# EasyEDA Pro project Loongson_Drivers.epro, board PCB1
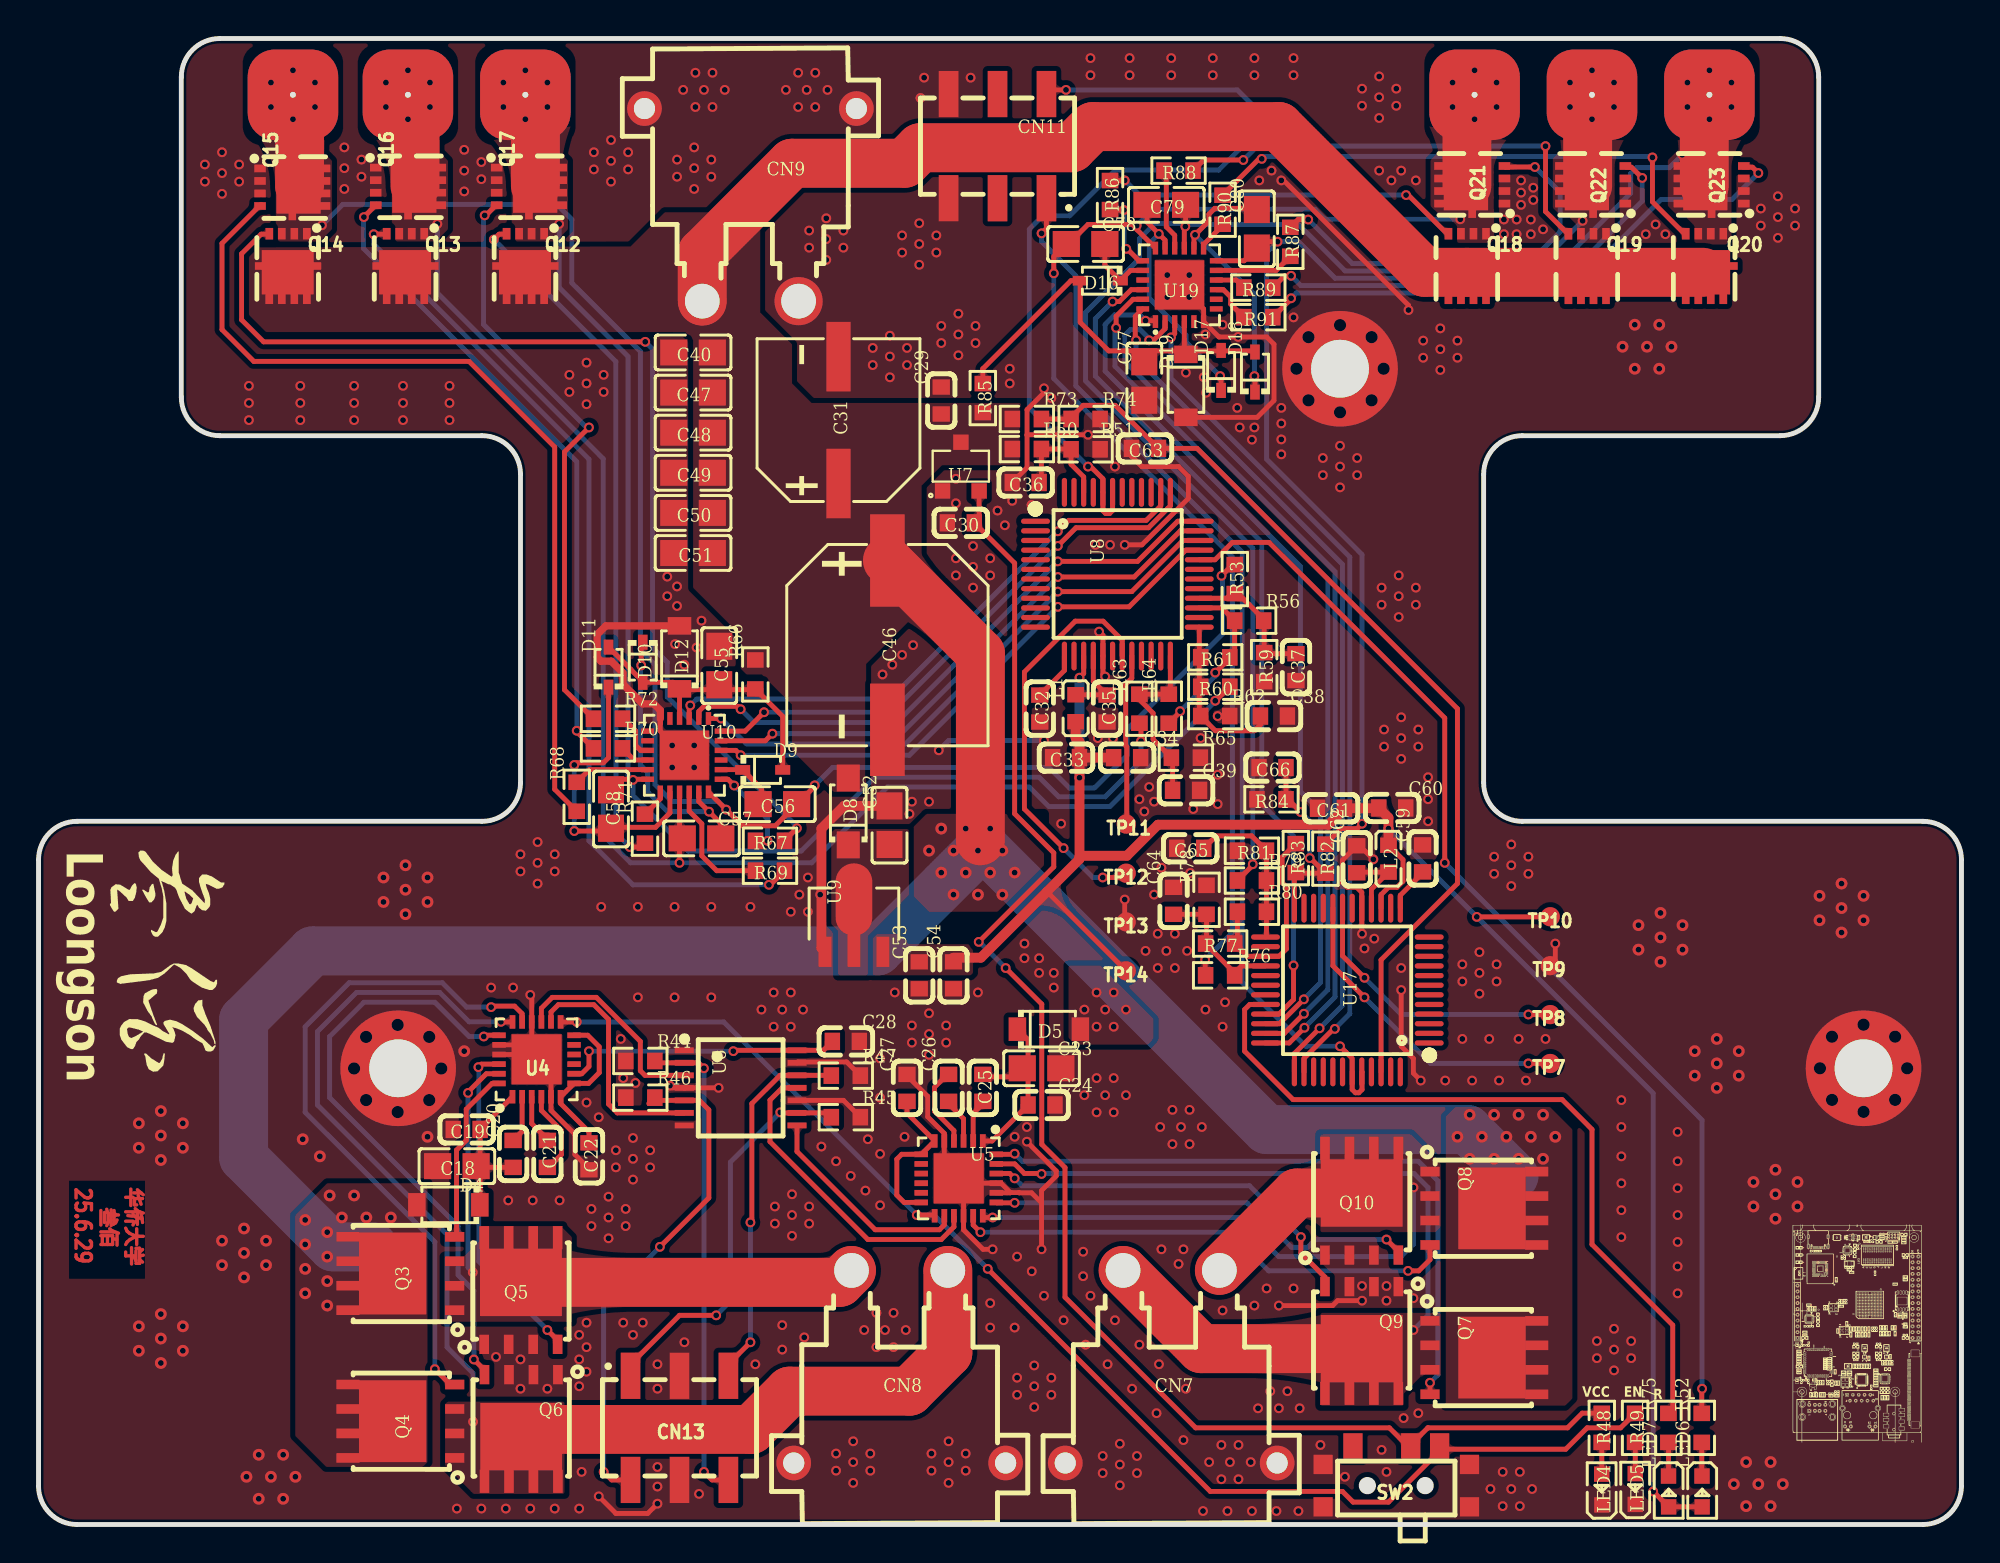
[diagram p3: board, top side]
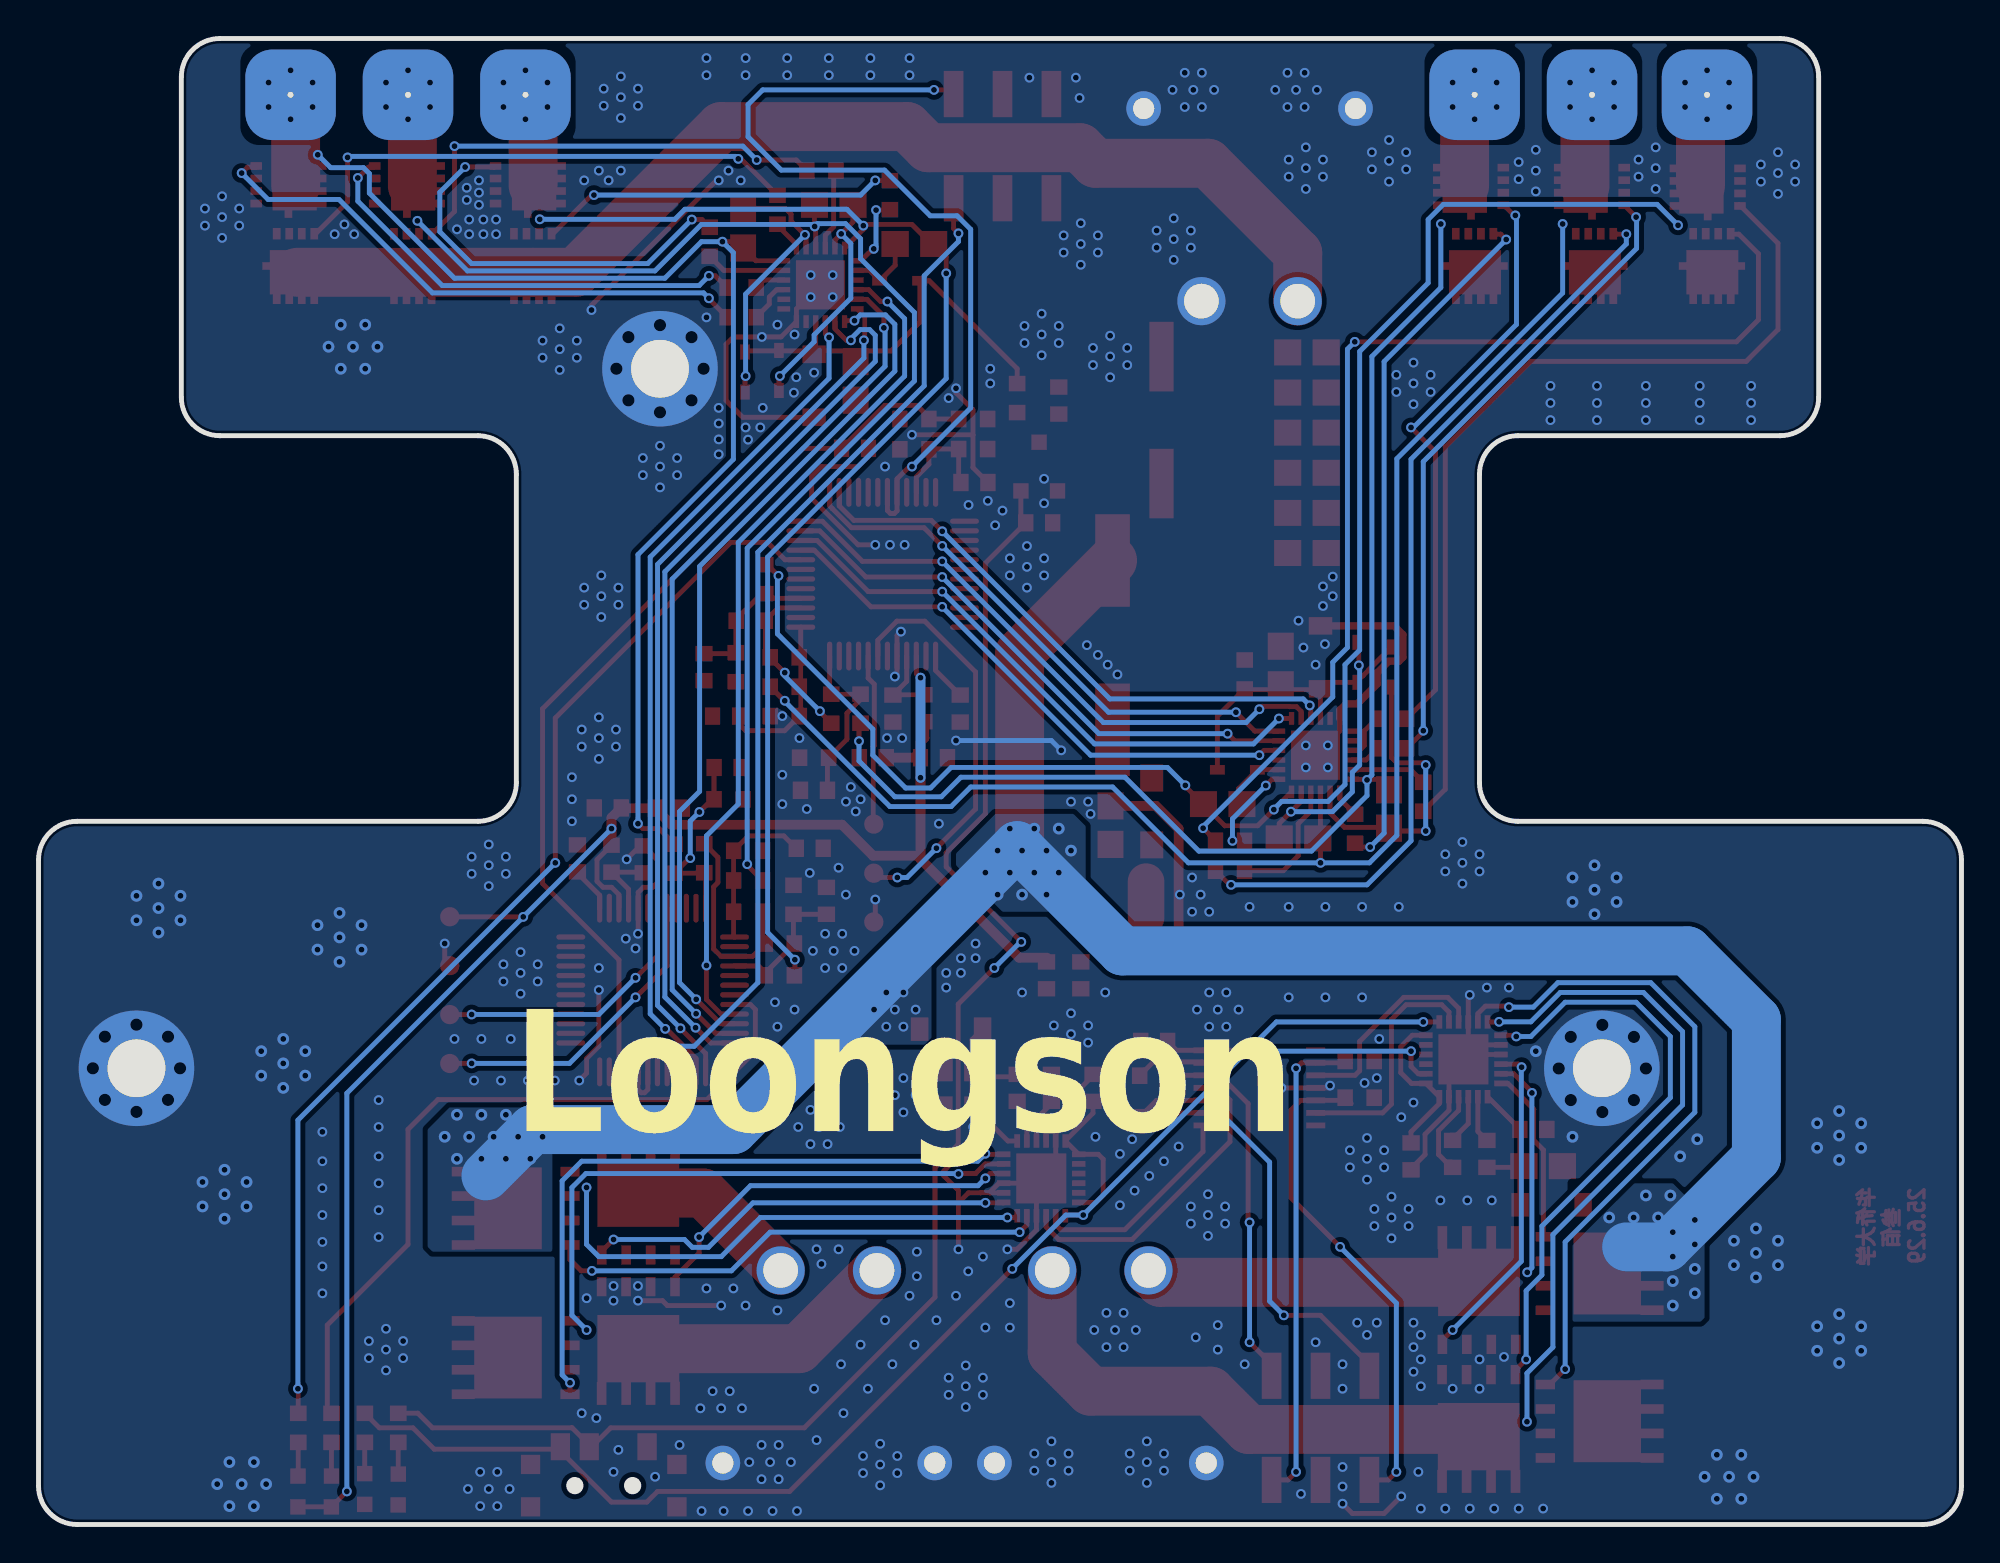
[diagram p4: board, bottom side, seen from below]

Outline 99.83 x 77.15 mm; copper layers: Top Layer, Bottom Layer. Coordinates in mm from the lower left corner of the outline.
Outline path: 0,34.51 arc(0.59,35.92) 2,36.51 23.02,36.51 arc(24.44,37.09) 25.02,38.51 25.02,54.53 arc(24.44,55.95) 23.02,56.53 9.41,56.53 arc(8,57.12) 7.41,58.53 7.41,75.15 arc(8,76.57) 9.41,77.15 90.41,77.15 arc(91.83,76.57) 92.41,75.15 92.41,58.53 arc(91.83,57.12) 90.41,56.53 77.02,56.53 arc(75.61,55.95) 75.02,54.53 75.02,38.51 arc(75.61,37.09) 77.02,36.51 97.83,36.51 arc(99.24,35.92) 99.83,34.51 99.83,2 arc(99.24,0.59) 97.83,0 2,0 arc(0.59,0.59) 0,2 0,34.51
Stack: Top Layer 0.035mm / Dielectric1 1.51mm FR4 er 4.5 / Bottom Layer 0.035mm

## Design rules (mm)
template: 自定义配置
spacing copperThickness1oz (default): track to track 0.102, other pairs 0.152 to 0.3
spacing copperThickness2oz: track to track 0.203, other pairs 0.152 to 0.3
track width copperThickness1oz (default): min 0.127, default 0.254, max 2.54
track width copperThickness2oz: min 0.203, default 0.254, max 2.54
differential pair differentialPair (default): width min 0.127, default 0.254, max 2.54; gap min 0.152, default 0.152
via viaSize (default): diameter min 0.5, default 0.61, max 10; hole min 0.3, default 0.305, max 6.3

## Placement (name value [footprint] x y rotation side)
C18  10uF  [C0805]  21.72 18.61 0 top
C19  100nF  [C0603]  22.22 20.51 0 top
C20  1uF  [C0603]  24.64 19.24 270 top
C21  100nF  [C0603]  26.42 19.24 90 top
C22  1uF  [C0603]  28.57 19.11 90 top
C23  10uF  [C0805]  52.07 23.69 180 top
C24  100nF  [C0603]  52.07 21.78 180 top
C25  1uF  [C0603]  49.02 22.67 90 top
C26  100nF  [C0603]  47.24 22.67 270 top
C27  1uF  [C0603]  45.08 22.67 270 top
C28  1uF  [C0603]  41.91 25.08 180 top
C29  1uF  [C0603]  46.86 58.36 270 top
C30  1uF  [C0603]  47.88 52.01 0 top
C31  220uF  [CAP-SMD_BD8.0-L8.3-W8.3-LS9.1-FD]  41.53 57.34 90 top
C32  100nF  [C0603]  51.98 42.36 90 top
C33  100nF  [C0603]  53.34 39.81 0 top
C34  10uF  [C0603]  56.51 39.81 180 top
C35  100nF  [C0603]  55.47 42.36 90 top
C36  100nF  [C0603]  51.24 54.1 0 top
C37  100nF  [C0603]  65.28 44.51 90 top
C38  100nF  [C0603]  64.13 41.97 180 top
C39  100nF  [C0603]  59.57 38.12 180 top
C40  22uF  [C0805]  33.98 60.85 0 top
C46  470uF  [CAP-SMD_BD10.0-L10.3-W10.3-LS11.0-R-RD]  44.07 45.66 90 top
C47  22uF  [C0805]  33.98 58.77 0 top
C48  22uF  [C0805]  33.98 56.69 0 top
C49  22uF  [C0805]  33.98 54.6 0 top
C50  22uF  [C0805]  33.98 52.52 0 top
C51  22uF  [C0805]  33.98 50.44 0 top
C52  22uF  [C0805]  44.18 36.31 270 top
C53  10uF  [C0603]  45.72 28.51 270 top
C54  100nF  [C0603]  47.5 28.51 270 top
C55  22uF  [C0805]  35.34 44.6 90 top
C56  4.7uF  [C0805]  38.35 37.4 0 top
C57  4.7uF  [C0805]  34.42 35.62 180 top
C58  4.7uF  [C0805]  29.72 37.15 90 top
C59  100nF  [C0603]  71.85 34.59 270 top
C60  100nF  [C0603]  70.28 37.2 180 top
C61  10uF  [C0603]  67.1 37.19 0 top
C62  100nF  [C0603]  68.43 34.54 270 top
C63  100nF  [C0603]  57.44 55.87 0 top
C64  100nF  [C0603]  58.92 32.38 270 top
C65  100nF  [C0603]  59.79 35.11 0 top
C66  100nF  [C0603]  64.06 39.3 0 top
C77  22uF  [C0805]  57.4 59.37 270 top
C78  4.7uF  [C0805]  54.36 66.48 180 top
C79  4.7uF  [C0805]  58.55 68.52 0 top
C80  4.7uF  [C0805]  63.25 67.27 270 top
CN7  XT30PW-M30.G.Y  [CONN-TH_XT30PW-M]  58.8 8.19 0 top
CN8  XT30PW-M30.G.Y  [CONN-TH_XT30PW-M]  44.7 8.19 0 top
CN9  XT30PW-M30.G.Y  [CONN-TH_XT30PW-M]  36.96 68.52 180 top
CN11  PM254-2-03-S-8.5  [HDR-SMD_6P-P2.54-V-F-R2-C3-LS7.0]  49.78 71.56 180 top
CN13  PM254-2-03-S-8.5  [HDR-SMD_6P-P2.54-V-F-R2-C3-LS7.0]  33.27 5.02 0 top
D4  1N5819HW  [SOD-123_L2.7-W1.6-LS3.7-RD]  21.28 16.6 180 top
D5  1N5819HW  [SOD-123_L2.7-W1.6-LS3.7-RD]  52.45 25.72 0 top
D8  DSK34  [SOD-123FL_L2.7-W1.8-LS3.8-RD]  42.04 37.02 90 top
D9  B5819WS  [SOD-323_L1.7-W1.3-LS2.5-FD]  37.59 39.18 180 top
D10  B5819WS  [SOD-323_L1.7-W1.3-LS2.5-FD]  31.37 44.77 90 top
D11  B5819WS  [SOD-323_L1.7-W1.3-LS2.5-FD]  29.59 44.51 270 top
D12  BZT52C15  [SOD-123_L2.7-W1.6-LS3.7-RD]  33.27 45.02 90 top
D16  B5819WS  [SOD-323_L1.7-W1.3-LS2.5-FD]  55.12 64.58 0 top
D17  B5819WS  [SOD-323_L1.7-W1.3-LS2.5-FD]  61.39 59.92 270 top
D18  B5819WS  [SOD-323_L1.7-W1.3-LS2.5-FD]  63.15 59.84 270 top
D19  BZT52C15  [SOD-123_L2.7-W1.6-LS3.7-RD]  59.56 59.12 270 top
L1  MLB1608F-000T  [L0603]  53.84 42.38 270 top
L2  MLB1608F-000T  [L0603]  70.08 34.57 90 top
LED4  NCD0603R1  [LED0603-RD_RED]  81.15 1.81 90 top
LED5  NCD0603B1  [LED0603-RD]  82.89 1.84 90 top
LED6  NCD0603R1  [LED0603-RD_RED]  86.36 1.71 270 top
LED7  NCD0603R1  [LED0603-RD_RED]  84.62 1.71 270 top
NOREF  -  [Pad_e1275]  94.74 23.69 0 top
NOREF#2  -  [Pad_e35]  74.55 74.23 0 top
NOREF#3  -  [Pad_e41]  80.64 74.23 0 top
NOREF#4  -  [Pad_e86]  25.27 74.23 0 top
NOREF#5  -  [Pad_e85]  19.18 74.23 0 top
NOREF#6  -  [Pad_e216]  67.56 60.01 0 top
NOREF#7  -  [Pad_e84]  13.21 74.23 0 top
NOREF#8  -  [Pad_e42]  86.74 74.23 0 top
NOREF#9  -  [Pad_e1305]  18.67 23.69 0 top
Q3  TPH1R403NL  [DSOP-8_L5.0-W5.0-P1.27-LS6.0-BL-EP]  18.83 13.03 90 top
Q4  TPH1R403NL  [DSOP-8_L5.0-W5.0-P1.27-LS6.0-BL-EP]  18.83 5.36 90 top
Q5  TPH1R403NL  [DSOP-8_L5.0-W5.0-P1.27-LS6.0-BL-EP]  25.04 12.12 0 top
Q6  TPH1R403NL  [DSOP-8_L5.0-W5.0-P1.27-LS6.0-BL-EP]  25.06 5.01 180 top
Q7  TPH1R403NL  [DSOP-8_L5.0-W5.0-P1.27-LS6.0-BL-EP]  75 8.67 270 top
Q8  TPH1R403NL  [DSOP-8_L5.0-W5.0-P1.27-LS6.0-BL-EP]  75 16.42 270 top
Q9  TPH1R403NL  [DSOP-8_L5.0-W5.0-P1.27-LS6.0-BL-EP]  68.69 9.58 180 top
Q10  TPH1R403NL  [DSOP-8_L5.0-W5.0-P1.27-LS6.0-BL-EP]  68.69 16.76 0 top
Q12  TPN2R805PL,L1Q  [TSON-8_L3.1-W3.1-P0.65-LS3.3-BL-EP]  25.27 65.34 180 top
Q13  TPN2R805PL,L1Q  [TSON-8_L3.1-W3.1-P0.65-LS3.3-BL-EP]  19.05 65.34 180 top
Q14  TPN2R805PL,L1Q  [TSON-8_L3.1-W3.1-P0.65-LS3.3-BL-EP]  12.95 65.34 180 top
Q15  TPN2R805PL,L1Q  [TSON-8_L3.1-W3.1-P0.65-LS3.3-BL-EP]  13.17 69.43 270 top
Q16  TPN2R805PL,L1Q  [TSON-8_L3.1-W3.1-P0.65-LS3.3-BL-EP]  19.18 69.47 270 top
Q17  TPN2R805PL,L1Q  [TSON-8_L3.1-W3.1-P0.65-LS3.3-BL-EP]  25.46 69.47 270 top
Q18  TPN2R805PL,L1Q  [TSON-8_L3.1-W3.1-P0.65-LS3.3-BL-EP]  74.17 65.34 180 top
Q19  TPN2R805PL,L1Q  [TSON-8_L3.1-W3.1-P0.65-LS3.3-BL-EP]  80.4 65.34 180 top
Q20  TPN2R805PL,L1Q  [TSON-8_L3.1-W3.1-P0.65-LS3.3-BL-EP]  86.49 65.34 180 top
Q21  TPN2R805PL,L1Q  [TSON-8_L3.1-W3.1-P0.65-LS3.3-BL-EP]  74.43 69.56 90 top
Q22  TPN2R805PL,L1Q  [TSON-8_L3.1-W3.1-P0.65-LS3.3-BL-EP]  80.7 69.56 90 top
Q23  TPN2R805PL,L1Q  [TSON-8_L3.1-W3.1-P0.65-LS3.3-BL-EP]  86.85 69.56 90 top
R44  10kΩ  [R0603]  31.24 24.07 180 top
R45  10kΩ  [R0603]  41.91 21.15 180 top
R46  10kΩ  [R0603]  31.24 22.16 180 top
R47  10kΩ  [R0603]  41.91 23.3 180 top
R48  2.2kΩ  [R0603]  81.15 5.02 90 top
R49  2.2kΩ  [R0603]  82.88 5.02 90 top
R50  47kΩ  [R0603]  51.31 55.84 180 top
R51  10kΩ  [R0603]  54.36 55.82 180 top
R52  10kΩ  [R0603]  86.34 5.02 270 top
R53  5.1kΩ  [R0603]  62.1 49.09 90 top
R56  1kΩ  [R0603]  62.85 46.93 180 top
R59  1kΩ  [R0603]  63.63 44.51 90 top
R60  5.1kΩ  [R0603]  61.09 43.5 0 top
R61  1kΩ  [R0603]  61.09 45.02 0 top
R62  1kΩ  [R0603]  61.09 41.97 180 top
R63  5.1kΩ  [R0603]  57.15 42.35 270 top
R64  1kΩ  [R0603]  58.67 42.35 270 top
R65  1kΩ  [R0603]  59.56 39.81 180 top
R66  100Ω  [R0603]  37.21 44.13 270 top
R67  4.7Ω  [R0603]  37.97 35.5 0 top
R68  4.7Ω  [R0603]  27.94 37.78 270 top
R69  4.7Ω  [R0603]  37.97 33.95 0 top
R70  4.7Ω  [R0603]  29.56 40.3 180 top
R71  4.7Ω  [R0603]  31.48 36.13 270 top
R72  4.7Ω  [R0603]  29.56 41.83 180 top
R73  47kΩ  [R0603]  51.31 57.4 180 top
R74  10kΩ  [R0603]  54.36 57.4 180 top
R75  10kΩ  [R0603]  84.61 5.02 270 top
R76  5.1kΩ  [R0603]  61.34 28.51 180 top
R77  1kΩ  [R0603]  61.34 30.16 0 top
R78  1kΩ  [R0603]  60.63 32.43 270 top
R79  5.1kΩ  [R0603]  62.99 33.44 180 top
R80  1kΩ  [R0603]  62.99 31.81 180 top
R81  1kΩ  [R0603]  62.99 34.98 0 top
R82  5.1kΩ  [R0603]  66.81 34.57 90 top
R83  1kΩ  [R0603]  65.27 34.6 90 top
R84  1kΩ  [R0603]  64.01 37.65 0 top
R85  100Ω  [R0603]  49.02 58.48 90 top
R86  4.7Ω  [R0603]  55.63 69.02 90 top
R87  4.7Ω  [R0603]  64.98 66.6 90 top
R88  4.7Ω  [R0603]  59.18 70.29 0 top
R89  4.7Ω  [R0603]  63.32 64.22 0 top
R90  4.7Ω  [R0603]  61.47 68.26 90 top
R91  4.7Ω  [R0603]  63.32 62.68 0 top
SW2  SK-3296S-01-L1  [SW-SMD_3P-P1.50_L2.7-W6.6]  70.48 2.48 0 top
TP7  -  [Test-Point-0.5mm]  78.48 23.93 180 top
TP8  -  [Test-Point-0.5mm]  78.48 26.47 180 top
TP9  -  [Test-Point-0.5mm]  78.48 29.01 180 top
TP10  -  [Test-Point-0.5mm]  78.48 31.55 180 top
TP11  -  [Test-Point-0.5mm]  56.47 36.36 0 top
TP12  -  [Test-Point-0.5mm]  56.47 33.81 0 top
TP13  -  [Test-Point-0.5mm]  56.47 31.28 0 top
TP14  -  [Test-Point-0.5mm]  56.47 28.74 0 top
U4  DRV8701E  [VQFN-24_L4.0-W4.0-P0.50-BL-EP2.5]  25.85 24.15 0 top
U5  DRV8701E  [VQFN-24_L4.0-W4.0-P0.50-BL-EP2.5]  47.77 17.97 180 top
U6  SN74HC125PWR  [TSSOP-14_L5.0-W4.4-P0.65-LS6.5-BL]  36.45 22.67 270 top
U7  LR8341A-T33  [SOT-23-3L_L2.9-W1.6-P1.90-LS2.8-BL]  47.88 54.93 0 top
U8  STC32G12K128-35I-LQFP48  [LQFP-48_L7.0-W7.0-P0.50-LS9.0-BL]  56.01 49.34 270 top
U9  SE8650K2-HF  [SOT-89-3_L4.5-W2.5-P1.50-LS4.2-BR]  42.33 31.09 270 top
U10  FD6288Q  [QFN-24_L4.0-W4.0-P0.50-BL-EP2.6]  33.53 39.94 180 top
U17  STC32G12K128-35I-LQFP48  [LQFP-48_L7.0-W7.0-P0.50-LS9.0-BL]  67.94 27.75 90 top
U19  FD6288Q  [QFN-24_L4.0-W4.0-P0.50-BL-EP2.6]  59.23 64.36 0 top

## Footprints (pads in the part's own frame, mm; a bottom-side part is the same pattern mirrored in y, then rotated)
C0603
  rect 0.8x0.9 smd: 1(-0.7,0) 2(0.7,0)
C0805
  rect 1.41x1.35 smd: 1(-1,0) 2(1,0)
CAP-SMD_BD8.0-L8.3-W8.3-LS9.1-FD
  rect 3.61x1.26 smd: 1(-3.295,0) 2(3.295,0)
CAP-SMD_BD10.0-L10.3-W10.3-LS11.0-R-RD
  rect 4.8x1.8 smd: 1(4.395,0) 2(-4.395,0)
CONN-TH_XT30PW-M
  round 2.5 hole 1.8: 1(-2.5,5) 2(2.5,5)
  round 1.8 hole 1.1: 3(5.5,-5) 4(-5.5,-5)
DSOP-8_L5.0-W5.0-P1.27-LS6.0-BL-EP
  rect 0.5x1 smd: 1(-1.905,-2.77) 2(-0.635,-2.77) 3(0.634,-2.77) 4(1.905,-2.77)
  rect 0.5x1.2 smd: 5(1.905,2.77) 6(0.635,2.77) 7(-0.634,2.77) 8(-1.905,2.77)
  custom 4.25x3.5 smd: 9(0,0.45)
HDR-SMD_6P-P2.54-V-F-R2-C3-LS7.0
  rect 1.02x2.4 smd: 1(-2.54,2.704) 2(0,2.704) 3(2.54,2.704) 4(2.54,-2.704) 5(0,-2.704) 6(-2.54,-2.704)
L0603
  rect 0.8x0.864 smd: 1(-0.7,0) 2(0.7,0)
LED0603-RD
  rect 0.8x0.8 smd: 1(-0.799,0) 2(0.799,0)
LED0603-RD_RED
  rect 0.8x0.8 smd: 1(-0.799,-0.004) 2(0.799,0.004)
LQFP-48_L7.0-W7.0-P0.50-LS9.0-BL
  oval 0.27x1.5 smd: 1(-2.75,-4.25) 2(-2.25,-4.25) 3(-1.75,-4.25) 4(-1.25,-4.25) 5(-0.75,-4.25) 6(-0.25,-4.25) 7(0.25,-4.25) 8(0.75,-4.25) 9(1.25,-4.25) 10(1.75,-4.25) 11(2.25,-4.25) 12(2.75,-4.25) 25(2.75,4.25) 26(2.25,4.25) 27(1.75,4.25) 28(1.25,4.25) 29(0.75,4.25) 30(0.25,4.25) 31(-0.25,4.25) 32(-0.75,4.25) 33(-1.25,4.25) 34(-1.75,4.25) 35(-2.25,4.25) 36(-2.75,4.25)
  oval 1.5x0.27 smd: 13(4.25,-2.75) 14(4.25,-2.25) 15(4.25,-1.75) 16(4.25,-1.25) 17(4.25,-0.75) 18(4.25,-0.25) 19(4.25,0.25) 20(4.25,0.75) 21(4.25,1.25) 22(4.25,1.75) 23(4.25,2.25) 24(4.25,2.75) 37(-4.25,2.75) 38(-4.25,2.25) 39(-4.25,1.75) 40(-4.25,1.25) 41(-4.25,0.75) 42(-4.25,0.25) 43(-4.25,-0.25) 44(-4.25,-0.75) 45(-4.25,-1.25) 46(-4.25,-1.75) 47(-4.25,-2.25) 48(-4.25,-2.75)
Pad_e35
  rrect 4.7x4.7 hole 0.305: 1(0,0)
Pad_e41
  rrect 4.7x4.7 hole 0.305: 1(0,0)
Pad_e42
  rrect 4.7x4.7 hole 0.305: 1(0,0)
Pad_e84
  rrect 4.7x4.7 hole 0.305: 1(0,0)
Pad_e85
  rrect 4.7x4.7 hole 0.305: 1(0,0)
Pad_e86
  rrect 4.7x4.7 hole 0.305: 1(0,0)
Pad_e216
  round 6 hole 3: 1(0,0)
Pad_e1275
  round 6 hole 3: 1(0,0)
Pad_e1305
  round 6 hole 3: 1(0,0)
QFN-24_L4.0-W4.0-P0.50-BL-EP2.6
  rect 0.28x0.665 smd: 1(-1.25,-1.907) 2(-0.75,-1.907) 3(-0.25,-1.907) 4(0.25,-1.907) 5(0.75,-1.907) 6(1.25,-1.907) 13(1.25,1.907) 14(0.75,1.907) 15(0.25,1.907) 16(-0.25,1.907) 17(-0.75,1.907) 18(-1.25,1.907)
  rect 0.665x0.28 smd: 7(1.907,-1.25) 8(1.907,-0.75) 9(1.907,-0.25) 10(1.907,0.25) 11(1.907,0.75) 12(1.907,1.25) 19(-1.907,1.25) 20(-1.907,0.75) 21(-1.907,0.25) 22(-1.907,-0.25) 23(-1.907,-0.75) 24(-1.907,-1.25)
  rect 2.55x2.55 smd: 25(0,0)
R0603
  rect 0.806x0.864 smd: 1(-0.753,0) 2(0.753,0)
SOD-123_L2.7-W1.6-LS3.7-RD
  rect 0.91x1.22 smd: 1(-1.635,0) 2(1.635,0)
SOD-123FL_L2.7-W1.8-LS3.8-RD
  rect 1.4x1.2 smd: 1(-1.735,0) 2(1.735,0)
SOD-323_L1.7-W1.3-LS2.5-FD
  rect 0.78x0.5 smd: 1(-1.04,0) 2(1.04,0)
SOT-23-3L_L2.9-W1.6-P1.90-LS2.8-BL
  rect 0.8x0.8 smd: 1(-0.95,-1.265) 2(0.95,-1.265) 3(0.005,1.265)
SOT-89-3_L4.5-W2.5-P1.50-LS4.2-BR
  rect 1.575x0.672 smd: 1(1.356,-1.5) 3(1.356,1.5)
  custom 5.377x1.9 smd: 2(-1.356,0)
SW-SMD_3P-P1.50_L2.7-W6.6
  rect 1x1 smd: 0(-3.8,0.641) 0(-3.8,-1.559) 0(3.8,0.641) 0(3.8,-1.559)
  rect 1x1.4 smd: 1(-2.25,1.559) 2(0.75,1.559) 3(2.25,1.559)
Test-Point-0.5mm
  round 1 smd: 1(0,0)
TSON-8_L3.1-W3.1-P0.65-LS3.3-BL-EP
  rect 0.4x0.6 smd: 1(-0.975,-1.675) 2(-0.325,-1.675) 3(0.325,-1.675) 4(0.975,-1.675) 5(0.975,1.675) 6(0.325,1.675) 7(-0.325,1.675) 8(-0.975,1.675)
  rect 0.6x0.4 smd: 9(-1.42,0) 9(1.42,0)
  rect 2.7x2.3 smd: 9(0.02,0.325)
TSSOP-14_L5.0-W4.4-P0.65-LS6.5-BL
  rect 0.305x0.991 smd: 1(-1.95,-2.925) 2(-1.3,-2.925) 3(-0.65,-2.925) 4(0,-2.925) 5(0.65,-2.925) 6(1.3,-2.925) 7(1.95,-2.925) 8(1.95,2.925) 9(1.3,2.925) 10(0.65,2.925) 11(0,2.925) 12(-0.65,2.925) 13(-1.3,2.925) 14(-1.95,2.925)
VQFN-24_L4.0-W4.0-P0.50-BL-EP2.5
  rect 0.3x0.7 smd: 1(-1.25,-1.942) 2(-0.75,-1.942) 3(-0.25,-1.942) 4(0.25,-1.942) 5(0.75,-1.942) 6(1.25,-1.942) 13(1.25,1.942) 14(0.75,1.942) 15(0.25,1.942) 16(-0.25,1.942) 17(-0.75,1.942) 18(-1.25,1.942)
  rect 0.7x0.3 smd: 7(1.948,-1.25) 8(1.948,-0.75) 9(1.948,-0.25) 10(1.948,0.25) 11(1.948,0.75) 12(1.948,1.25) 19(-1.948,1.25) 20(-1.948,0.75) 21(-1.948,0.25) 22(-1.948,-0.25) 23(-1.948,-0.75) 24(-1.948,-1.25)
  rect 2.6x2.6 smd: 25(0.001,-0.001)

## Nets
As in the schematic, except:
GND: C18.1 C19.1 C22.1 C23.1 C24.1 C27.1 C28.1 C29.1 C30.1 C31.2 C32.1 C33.1 C34.1 C35.1 C36.1 C37.1 C38.1 C39.1 C40.1 C46.2 C47.1 C48.1 C49.1 C50.1 C51.1 C52.1 C53.2 C54.2 C55.2 C59.1 C60.1 C61.1 C62.1 C63.1 C64.1 C65.1 C66.1 C77.2 CN7.3 CN7.4 CN8.3 CN8.4 CN9.1 CN9.3 CN9.4 CN11.3 CN11.4 CN13.2 CN13.5 D12.2 D19.2 LED4.1 LED5.1 NOREF.1 NOREF#6.1 NOREF#9.1 Q5.1 Q5.2 Q5.3 Q6.1 Q6.2 Q6.3 Q9.1 Q9.2 Q9.3 Q10.1 Q10.2 Q10.3 Q15.1 Q15.2 Q15.3 Q16.1 Q16.2 Q16.3 Q17.1 Q17.2 Q17.3 Q21.1 Q21.2 Q21.3 Q22.1 Q22.2 Q22.3 Q23.1 Q23.2 Q23.3 R44.2 R45.1 R46.2 R47.1 R51.1 R59.1 R62.1 R65.1 R74.1 R78.1 R81.1 R84.1 SW2.0 TP9.1 TP13.1 U4.5 U4.16 U4.20 U4.21 U4.25 U5.5 U5.16 U5.20 U5.21 U5.25 U6.1 U6.4 U6.7 U6.10 U6.13 U7.1 U8.17 U9.1 U10.6 U10.25 U17.17 U19.6 U19.25
VSA1: C56.2 NOREF#7.1 Q14.1 Q14.2 Q14.3 Q15.5 Q15.6 Q15.7 Q15.8 Q15.9 R53.2 U10.18
VSA2: C78.2 NOREF#2.1 Q18.1 Q18.2 Q18.3 Q21.5 Q21.6 Q21.7 Q21.8 Q21.9 R76.2 U19.18
VSB1: C57.2 NOREF#5.1 Q13.1 Q13.2 Q13.3 Q16.5 Q16.6 Q16.7 Q16.8 Q16.9 R60.2 U10.15
VSB2: C79.2 NOREF#3.1 Q19.1 Q19.2 Q19.3 Q22.5 Q22.6 Q22.7 Q22.8 Q22.9 R79.2 U19.15
VSC1: C58.2 NOREF#4.1 Q12.1 Q12.2 Q12.3 Q17.5 Q17.6 Q17.7 Q17.8 Q17.9 R63.2 U10.12
VSC2: C80.2 NOREF#8.1 Q20.1 Q20.2 Q20.3 Q23.5 Q23.6 Q23.7 Q23.8 Q23.9 R82.2 U19.12

Pads without a net: CN11 2 5; SW2 1; U4 9 10 11; U5 8 9 10 11; U8 1 2 3 4 5 6 7 8 9 10 11 12 14 18 21 22 23 26 29 30 31 39 40 41 42 45 47 48; U10 5 7 8 21; U17 1 2 3 4 5 6 7 8 9 10 11 12 14 18 21 22 23 26 29 30 31 39 40 41 42 45 47 48; U19 5 7 8 21

## Via types
v1: diameter 0.61, hole 0.305, Top Layer to Bottom Layer, 157 vias
v2: diameter 0.508, hole 0.305, Top Layer to Bottom Layer, 695 vias
v3: diameter 0.889, hole 0.635, Top Layer to Bottom Layer, 24 vias

## Routing (per net, layer and track width the routed paths; a pad name or vN(x,y) marks a point on that pad's centre or on a via; arc(x,y) is an arc through that point)
+5V: length 99.8
  Top Layer w0.254: LED6.2 84.62,0.92 v2(83.82,1.71) ; TP14.1 52.35,32.86 ; v2(54.04,43.97) 54.26,44.18 U8.15 ; L2.2 70.83,34.52 70.83,33.4 70.52,33.08 70.08,33.08 69.69,32.7 U17.15 ; TP10.1 78.47,31.55 v2(74.66,31.55)
  Top Layer w0.508: L1.2 53.84,40.84 54.04,40.64 C33.2 ; 54.04,34.67 54.04,34.55 48.92,29.43 47.48,29.43 ; 54.04,34.67 54.09,34.72 56.5,34.72 58.11,36.33 66.97,36.33 67.81,37.18 67.8,37.19 69.56,37.19 C60.2 70.08,36.7 v2(70.08,36.13) L2.2 ; 54.04,34.67 v2(54.04,38.77) C33.2 ; C33.2 C34.2
  Bottom Layer w0.254: v2(83.82,1.71) 83.82,22.39 v2(74.66,31.55) v2(70.08,36.13)
  Bottom Layer w0.508: v2(54.04,43.97) v2(54.04,38.77)
DVDD: length 14.6
  Top Layer w0.254: v2(36.07,24.57) 36.11,24.62 U6.14 40.75,24.62 C28.2 ; v2(28.57,24.57) 28.57,23.78 28.2,23.4 U4.8
  Bottom Layer w0.254: v2(28.57,24.57) v2(36.07,24.57)
GND: length 143.4
  Top Layer w0.254: v2(25.53,27.5) 25.6,27.42 U4.16 25.6,24.4 ; v2(32.13,1.08) 31.62,0.57 29.97,0.57 v2(29.08,1.46) ; 25.6,24.4 U4.25 26.6,23.4 U4.5 26.6,21.5 27.85,20.26 27.85,19.21 28.39,18.67 28.57,18.67 ; 25.6,24.4 U4.21 ; 25.6,24.4 25.1,24.9 U4.20 ; v2(61.21,41.97) R62.1 ; TP9.1 78.74,29.28 v2(78.74,30.16) ; 48.02,17.72 48.02,15.3 49.03,14.29 v2(49.53,14.29) ; 48.02,17.72 U5.21 49.97,17.72 50.45,17.23 ; 48.02,17.72 U5.25 47.02,18.72 47.02,20.31 46.16,21.17 46.16,22.23 45.15,23.24 44.96,23.24 ; v2(51.31,19.88) 52.83,18.35 52.83,18.1 52.07,17.34 52.07,16.7 ; U10.6 32.28,41.19 U10.25 ; 51.32,56.57 51.32,57.88 52.2,58.76 v2(52.2,58.99) ; 51.32,56.57 51.32,56.58 52.28,56.58 52.29,56.58 53.38,56.58 53.38,56.58 v2(54.48,56.58) ; 51.32,56.57 51.32,54.87 C36.1 ; C63.1 56.74,55.47 57.28,54.93 59.18,54.93 59.69,54.42 59.69,53.28 57.28,50.86 v2(56.39,50.86) ; D19.2 63.26,57.48 64.13,58.36 64.13,61.28 63.75,61.66 v2(62.27,61.66) 61.28,61.66 U19.6 60.48,63.11 U19.25 ; v2(71.75,23.05) 71.37,23.43 71.37,24.19 70.74,24.83 v2(70.74,27.75) ; U5.20 50.44,17.22 50.45,17.23 ; 50.45,17.23 50.89,17.23 50.91,17.22 51.55,17.22 52.07,16.7 ; v2(55.37,44.03) 55.26,44.14 U8.17 55.26,46.16 v2(55.06,46.36) ; v2(69.29,34.54) 68.59,35.24 C62.1 67.69,34.5 67.69,33.34 67.7,33.33 67.7,33.32 67.87,33.16 67.87,33.16 67.94,33.08 68.43,33.08 68.69,32.82 U17.17 68.69,30.68 v2(68.71,30.67) ; 52.07,16.7 v2(52.07,14.29) ; v2(64.39,11.37) 67.18,11.37 67.44,11.62 v2(68.71,11.62) ; v2(32.78,22.79) 32.9,22.67 U6.4 v2(35.31,22.67) ; v2(64.52,69.79) 64.63,69.79 71.12,63.3 v2(71.12,63.06) ; U6.13 39.42,24.02 41.95,24.02 R47.1 ; v2(56.39,32.45) 56.39,31.36 TP13.1 ; U6.10 41.79,22.02 R45.1
  Top Layer w0.381: D12.2 29.45,46.66 29,46.21 29,45.02 29.2,44.82 29.73,44.82 30.33,44.22 30.33,43.64 31.36,42.61 31.94,42.61 32.28,42.27 U10.6
  Top Layer w0.508: C52.1 41.82,37.31 40.64,36.13 40.64,29.93 U9.1
  Bottom Layer w0.254: v2(46.74,40.2) 47.24,40.7 v2(52.2,40.7)
  vias: v1(5.21,20.83) v1(5.21,19.56) v1(5.21,10.29) v1(5.21,9.02) v1(6.35,21.46) v1(6.35,20.19) v1(6.35,18.92) v1(6.35,10.92) v1(6.35,9.65) v1(6.35,8.38) v1(7.49,20.83) v1(7.49,19.56) v1(7.49,10.29) v1(7.49,9.02) v1(9.52,14.73) v1(9.52,13.46) v1(10.67,15.37) v1(10.67,14.1) v1(10.67,12.83) v1(10.79,2.48) v1(11.43,3.62) v1(11.43,1.33) v1(11.81,14.73) v1(11.81,13.46) v1(12.06,2.48) v1(12.7,3.62) v1(12.7,1.33) v1(13.33,2.48) v1(13.72,20) v1(14.6,19.11) v1(17.91,33.59) v1(17.91,32.32) v1(19.05,34.23) v1(19.05,32.96) v1(19.05,31.69) v1(20.19,33.59) v1(20.19,32.32) v1(20.19,20.13) v1(22.1,24.57) v1(82.23,61.15) v1(82.87,62.29) v1(82.87,60.01) v1(83.06,31.12) v1(83.06,29.85) v1(83.5,61.15) v1(84.14,62.29) v1(84.14,60.01) v1(84.2,31.75) v1(84.2,30.48) v1(84.2,29.21) v1(84.77,61.15) v1(85.34,31.12) v1(85.34,29.85) v1(85.98,24.57) v1(85.98,23.3) v1(87.12,25.21) v1(87.12,23.94) v1(87.12,22.67) v1(88.01,2.1) v1(88.26,24.57) v1(88.26,23.3) v1(88.65,3.24) v1(88.65,0.95) v1(89.03,17.78) v1(89.03,16.51) v1(89.28,2.1) v1(89.92,3.24) v1(89.92,0.95) v1(90.17,18.42) v1(90.17,17.15) v1(90.17,15.88) v1(90.55,2.1) v1(91.31,17.78) v1(91.31,16.51) v1(92.46,32.64) v1(92.46,31.37) v1(93.6,33.28) v1(93.6,32.01) v1(93.6,30.74) v1(94.74,32.64) v1(94.74,31.37) v2(8.64,70.61) v2(8.64,69.72) v2(9.52,71.25) v2(9.52,70.17) v2(9.52,69.09) v2(10.41,70.61) v2(10.41,69.72) v2(10.92,59.12) v2(10.92,58.23) v2(10.92,57.34) v2(13.59,59.12) v2(13.59,58.23) v2(13.59,57.34) v2(15.88,71.5) v2(15.88,70.42) v2(15.88,69.34) v2(16.38,59.12) v2(16.38,58.23) v2(16.38,57.34) v2(16.76,70.87) v2(16.76,69.98) v2(18.92,59.12) v2(18.92,58.23) v2(18.92,57.34) v2(21.34,59.12) v2(21.34,58.23) v2(21.34,57.34) v2(21.72,0.83) v2(22.1,71.37) v2(22.1,70.29) v2(22.1,69.22) v2(22.99,70.74) v2(22.99,69.85) v2(22.99,0.83) v2(23.49,27.88) v2(23.75,8.7) v2(24.26,0.83) v2(24.38,16.83) v2(24.64,27.88) v2(25.02,34.8) v2(25.02,33.91) v2(25.02,8.57) v2(25.02,7.05) v2(25.53,0.83) v2(25.65,16.83) v2(25.91,35.43) v2(25.91,34.35) v2(25.91,33.27) v2(26.42,7.05) v2(26.8,34.8) v2(26.8,33.91) v2(26.8,0.83) v2(27.05,16.83) v2(27.56,59.69) v2(27.56,58.8) v2(28.07,9.84) v2(28.07,8.57) v2(28.07,7.18) v2(28.07,0.83) v2(28.19,2.73) v2(28.45,60.33) v2(28.45,59.25) v2(28.45,58.17) v2(28.45,21.91) v2(28.45,10.48) v2(28.45,9.21) v2(28.45,7.93) v2(28.7,16.38) v2(28.7,15.49) v2(28.83,71.25) v2(28.83,70.36) v2(29.08,21.15) v2(29.21,32.07) v2(29.34,59.69) v2(29.34,58.8) v2(29.59,17.02) v2(29.59,15.94) v2(29.59,14.86) v2(29.72,71.88) v2(29.72,70.8) v2(29.72,69.72) v2(29.97,19.43) v2(29.97,18.54) v2(30.23,25.21) v2(30.35,23.18) v2(30.35,10.48) v2(30.48,16.38) v2(30.48,15.49) v2(30.61,71.25) v2(30.61,70.36) v2(30.86,20.07) v2(30.86,18.99) v2(30.86,17.91) v2(30.86,9.84) v2(30.99,22.92) v2(31.11,32.07) v2(31.11,27.37) v2(31.37,10.48) v2(31.75,19.43) v2(31.75,18.54) v2(32.13,8.32) v2(32.13,7.05) v2(32.13,2.98) v2(32.13,1.97) v2(32.64,49.21) v2(32.64,48.2) v2(32.89,40.45) v2(32.89,39.31) v2(33.04,45.71) v2(33.02,32.07) v2(33.02,27.37) v2(33.15,70.87) v2(33.15,69.98) v2(33.15,48.7) v2(33.15,47.69) v2(33.46,74.49) v2(33.53,44.64) v2(33.53,9.46) v2(34.04,71.5) v2(34.04,70.42) v2(34.04,69.34) v2(34.04,40.45) v2(34.04,39.31) v2(34.1,75.37) v2(34.1,73.6) v2(34.16,45.53) v2(34.29,1.59) v2(34.42,46.93) v2(34.54,74.49) v2(34.92,70.87) v2(34.92,69.98) v2(34.92,32.07) v2(34.92,27.37) v2(34.99,75.37) v2(34.99,73.6) v2(35.62,74.49) v2(36.96,32.07) v2(37.21,8.32) v2(37.53,26.73) v2(38.16,27.62) v2(38.16,25.84) v2(38.23,16.51) v2(38.23,15.62) v2(38.61,26.73) v2(38.61,10.35) v2(38.61,9.08) v2(38.8,74.49) v2(39.05,31.81) v2(39.05,27.62) v2(39.05,25.84) v2(39.12,17.15) v2(39.12,16.07) v2(39.12,14.99) v2(39.43,75.37) v2(39.43,73.6) v2(39.5,32.7) v2(39.69,26.73) v2(39.75,9.72) v2(39.88,74.49) v2(39.94,33.59) v2(39.94,31.81) v2(40,67.18) v2(40,66.29) v2(40,16.51) v2(40,15.62) v2(40.32,75.37) v2(40.32,73.6) v2(40.58,32.7) v2(40.64,19.62) v2(40.96,74.49) v2(40.89,67.82) v2(40.89,66.74) v2(40.89,65.66) v2(41.4,18.86) v2(41.4,3.68) v2(41.4,2.79) v2(41.78,67.18) v2(41.78,66.29) v2(42.16,18.1) v2(42.29,4.32) v2(42.29,3.24) v2(42.29,2.16) v2(42.86,10.1) v2(42.93,17.34) v2(43.05,20) v2(43.18,3.68) v2(43.18,2.79) v2(43.31,61.09) v2(43.31,60.2) v2(43.5,10.99) v2(43.5,9.21) v2(43.69,24.19) v2(43.69,22.16) v2(43.69,19.24) v2(43.69,16.57) v2(43.81,44.13) v2(43.94,10.1) v2(44.2,61.72) v2(44.2,60.64) v2(44.2,59.56) v2(44.32,44.64) v2(44.45,27.62) v2(44.39,10.99) v2(44.39,9.21) v2(44.83,66.93) v2(44.83,66.04) v2(44.83,45.15) v2(44.96,20.13) v2(45.02,10.1) v2(45.08,61.09) v2(45.08,60.2) v2(45.21,36.89) v2(45.34,37.53) v2(45.34,25.91) v2(45.34,25.02) v2(45.4,45.66) v2(45.72,67.56) v2(45.72,66.48) v2(45.72,65.41) v2(45.78,74.06) v2(45.97,75.12) v2(46.23,37.53) v2(46.23,26.54) v2(46.23,25.46) v2(46.23,24.38) v2(46.35,3.68) v2(46.35,2.79) v2(46.61,66.93) v2(46.61,66.04) v2(46.86,62.23) v2(46.86,61.34) v2(47.12,25.91) v2(47.12,25.02) v2(47.24,4.32) v2(47.24,3.24) v2(47.24,2.16) v2(47.62,54.29) v2(47.62,53.02) v2(47.62,50.17) v2(47.62,49.28) v2(47.75,62.87) v2(47.75,61.79) v2(47.75,60.71) v2(48.13,3.68) v2(48.13,2.79) v2(48.39,75.12) v2(48.51,50.8) v2(48.51,49.72) v2(48.51,48.64) v2(48.64,62.23) v2(48.64,61.34) v2(48.77,27.62) v2(49.4,50.17) v2(49.4,49.28) v2(49.4,11.49) v2(49.4,10.22) v2(49.78,52.64) v2(50.16,51.88) v2(50.42,60.01) v2(50.42,59.25) v2(50.55,53.15) v2(50.67,20.13) v2(50.67,10.22) v2(50.8,13.91) v2(50.8,7.62) v2(50.8,6.73) v2(51.18,30.16) v2(51.18,29.4) v2(51.31,20.64) v2(51.55,52.93) v2(51.56,13.14) v2(51.69,8.26) v2(51.69,7.18) v2(51.69,6.1) v2(51.94,29.4) v2(51.94,28.64) v2(52.2,11.88) v2(52.58,58.48) v2(52.58,7.62) v2(52.58,6.73) v2(52.7,28.64) v2(52.7,27.88) v2(53.09,36.39) v2(53.21,10.6) v2(54.23,14.16) v2(54.23,12.89) v2(54.29,22.29) v2(54.36,9.33) v2(54.61,76.14) v2(54.61,75.25) v2(54.61,11.88) v2(54.86,50.86) v2(54.93,23.18) v2(54.93,21.4) v2(54.99,40.83) v2(55.25,3.56) v2(55.25,2.67) v2(55.37,22.29) v2(55.5,8.32) v2(55.63,50.86) v2(55.78,40.83) v2(55.82,23.18) v2(55.82,21.4) v2(55.88,54.93) v2(55.88,10.6) v2(56.13,4.19) v2(56.13,3.11) v2(56.13,2.03) v2(56.45,22.29) v2(56.64,76.14) v2(56.64,75.25) v2(56.77,7.05) v2(57.02,3.56) v2(57.02,2.67) v2(57.15,37.66) v2(57.15,9.33) v2(57.4,37.02) v2(57.47,29.78) v2(57.66,38.29) v2(57.91,37.53) v2(57.91,32.7) v2(58.04,5.78) v2(58.1,30.67) v2(58.1,28.89) v2(58.17,8.32) v2(58.23,20.64) v2(58.29,34.1) v2(58.29,14.29) v2(58.55,29.78) v2(58.6,64.87) v2(58.6,63.73) v2(58.8,76.14) v2(58.8,75.25) v2(58.86,21.53) v2(58.86,19.75) v2(58.99,30.67) v2(58.99,28.89) v2(59.18,13.53) v2(59.31,20.64) v2(59.44,14.29) v2(59.44,4.38) v2(59.56,59.81) v2(59.56,7.05) v2(59.63,29.78) v2(59.74,64.87) v2(59.74,63.73) v2(59.75,21.53) v2(59.75,19.75) v2(59.79,33.83) v2(59.94,37.15) v2(60.32,40.83) v2(60.39,20.64) v2(60.45,0.7) v2(60.49,59.57) v2(60.58,61.79) v2(60.61,58.76) v2(60.58,26.73) v2(60.77,3.24) v2(60.96,76.14) v2(60.96,75.25) v2(61.21,38.93) v2(61.21,37.4) v2(61.47,62.29) v2(61.47,25.84) v2(61.47,11.11) v2(61.4,4.13) v2(61.4,2.35) v2(61.59,27.11) v2(61.72,0.7) v2(61.85,3.24) v2(62.23,57.98) v2(62.36,56.96) v2(62.29,4.13) v2(62.29,2.35) v2(62.93,3.24) v2(62.99,56.32) v2(62.99,0.7) v2(63.12,76.14) v2(63.12,75.25) v2(63.12,56.96) v2(63.12,11.37) v2(63.37,69.79) v2(63.31,6.03) v2(63.75,12.26) v2(63.94,6.92) v2(64.01,70.29) v2(64.26,0.7) v2(64.39,6.03) v2(64.52,57.98) v2(64.52,57.17) v2(64.52,56.34) v2(64.52,55.56) v2(64.83,6.92) v2(65.15,76.14) v2(65.15,75.25) v2(65.15,62.67) v2(65.15,12.26) v2(65.47,6.03) v2(65.41,0.7) v2(66.55,4.13) v2(66.67,55.37) v2(66.67,54.48) v2(67.56,56.01) v2(67.56,54.93) v2(67.56,53.85) v2(67.82,2.48) v2(68.45,55.37) v2(68.45,54.48) v2(68.71,74.55) v2(68.71,73.66) v2(68.71,12.38) v2(68.83,29.91) v2(69.34,30.42) v2(69.6,75.18) v2(69.6,74.1) v2(69.6,73.03) v2(69.6,70.29) v2(69.72,48.64) v2(69.72,47.75) v2(69.72,3.87) v2(69.85,41.28) v2(69.85,40.39) v2(69.98,12.38) v2(69.98,11.62) v2(69.98,2.73) v2(70.23,69.79) v2(70.48,74.55) v2(70.48,73.66) v2(70.61,49.28) v2(70.61,48.2) v2(70.61,47.12) v2(70.74,70.29) v2(70.74,41.91) v2(70.74,40.83) v2(70.74,39.75) v2(70.74,28.89) v2(70.87,5.52) v2(71.37,11.75) v2(71.5,69.79) v2(71.5,48.64) v2(71.5,47.75) v2(71.63,41.28) v2(71.63,40.39) v2(71.63,5.78) v2(71.88,61.47) v2(71.88,60.58) v2(72.14,38.8) v2(72.14,37.66) v2(72.14,36.51) v2(72.77,62.1) v2(72.77,61.02) v2(72.77,59.94) v2(73.03,23.05) v2(73.66,61.47) v2(73.66,60.58) v2(73.91,29.08) v2(73.91,28.19) v2(73.91,25.21) v2(74.42,23.05) v2(74.8,29.72) v2(74.8,28.64) v2(74.8,27.56) v2(75.31,25.21) v2(75.37,1.84) v2(75.56,34.67) v2(75.56,33.78) v2(75.69,29.08) v2(75.69,28.19) v2(75.82,23.05) v2(76.07,67.75) v2(76.07,66.99) v2(76.01,2.73) v2(76.01,0.95) v2(76.45,35.31) v2(76.45,34.23) v2(76.45,33.15) v2(76.45,1.84) v2(76.73,67.75) v2(76.73,66.99) v2(76.83,25.21) v2(76.96,69.79) v2(76.96,69.15) v2(76.96,68.52) v2(76.9,2.73) v2(76.9,0.95) v2(77.22,23.05) v2(77.34,34.67) v2(77.34,33.78) v2(77.47,67.75) v2(77.47,66.99) v2(77.53,1.84) v2(77.6,69.41) v2(77.6,68.77) v2(78.1,67.25) v2(78.23,25.21) v2(80.9,9.53) v2(80.9,8.64) v2(81.79,10.16) v2(81.79,9.08) v2(81.79,8) v2(82.17,22.03) v2(82.17,20.64) v2(82.17,19.11) v2(82.17,17.72) v2(82.17,16.32) v2(82.17,14.92) v2(82.68,9.53) v2(82.68,8.64) v2(83.44,66.99) v2(83.95,67.5) v2(84.45,66.99) v2(85.09,20.38) v2(85.09,18.86) v2(85.09,17.46) v2(85.09,16.07) v2(85.09,14.67) v2(85.09,13.4) v2(85.09,12) v2(89.41,68.33) v2(89.41,67.44) v2(90.3,68.96) v2(90.3,67.88) v2(90.3,66.8) v2(91.19,68.33) v2(91.19,67.44) v3(16.38,23.68) v3(17,25.32) v3(17.01,22.03) v3(18.64,25.94) v3(18.64,21.41) v3(20.28,25.32) v3(20.28,22.03) v3(20.91,23.68) v3(65.3,60.01) v3(65.93,61.65) v3(65.93,58.37) v3(67.56,62.27) v3(67.56,57.74) v3(69.2,61.65) v3(69.2,58.37) v3(69.83,60.01) v3(92.48,23.69) v3(93.1,25.33) v3(93.1,22.05) v3(94.74,25.95) v3(94.74,21.42) v3(96.38,25.33) v3(96.38,22.05) v3(97.01,23.69)
VCCBAT: length 169.5
  Top Layer w2.54: 48.89,35.5 48.89,45.23 44.07,50.05 ; 86.4,65.01 Q19.9 71.96,65.01 64.39,72.58 54.74,72.58 53.64,71.48 45.76,71.48 44.96,70.68 39.12,70.68 34.46,66.02 CN9.2
  Bottom Layer w2.54: 76.6,18.1 74.19,20.5 63.76,20.5 49.02,35.24 v1(48.77,34.99) 43.56,29.78 14.22,29.78 10.65,26.2 10.65,19.05 15.29,14.41 17.38,14.41
  vias: v1(13.84,15.81) v1(13.84,14.54) v1(13.84,13.27) v1(13.84,12) v1(14.99,15.18) v1(14.99,13.91) v1(14.99,12.64) v1(14.99,11.37) v1(15.11,17.08) v1(15.75,15.94) v1(16.38,17.08) v1(17.02,15.94) v1(18.29,15.94) v1(46.23,34.99) v1(46.86,36.13) v1(46.86,33.85) v1(47.5,34.99) v1(47.5,32.7) v1(48.13,36.13) v1(48.13,33.85) v1(48.77,32.7) v1(49.4,36.13) v1(49.4,33.85) v1(50.04,34.99) v1(50.04,32.7) v1(50.67,33.85) v1(73.66,20.13) v1(74.29,21.27) v1(74.29,18.99) v1(74.93,20.13) v1(75.56,21.27) v1(75.56,18.99) v1(76.2,20.13) v1(76.83,21.27) v1(76.83,18.99) v1(77.47,20.13) v1(78.1,21.27) v1(78.1,18.99) v1(78.74,20.13) v2(54.29,26.73) v2(54.93,27.62) v2(54.93,25.84) v2(55.37,26.73) v2(55.82,27.62) v2(55.82,25.84) v2(56.45,26.73)
ABMF1: length 7.6
  Top Layer w0.254: U8.28 61.67,48.09 62.09,48.51 62.85,47.76 63.6,47 R56.1 63.63,46.9 R59.2 63.68,45.21 C37.2
ABMF2: length 7.1
  Top Layer w0.254: C64.2 R78.2 60.63,30.21 R77.1 60.59,30.15 62.09,28.64 62.46,29 U17.28
BATADC1: length 5.8
  Top Layer w0.254: U8.46 54.26,54.39 53.6,55.05 R51.2 53.59,55.84 R50.1 52.06,54.22 C36.2
BATADC2: length 49
  Top Layer w0.254: U17.46 69.69,29.31 73.66,33.28 73.66,42.35 60.14,55.87 C63.2 58.13,55.87 55.89,58.11 54.23,58.11 53.6,57.48 R74.2 R73.1
BBMF1: length 8.6
  Top Layer w0.254: U8.25 60.26,42.05 R62.2 61.1,41.21 63.12,41.21 63.44,41.53 C38.2
BBMF2: length 8.3
  Top Layer w0.254: U17.25 63.75,30.55 R80.1 R79.1 R81.2 62.98,35.75 61.13,35.75 C65.2
CBMF1: length 9.2
  Top Layer w0.254: C39.2 58.87,39.75 R65.2 57.86,40.76 57.86,42.12 57.15,42.83 R63.1 R64.1 58.76,43.19 U8.24
CBMF2: length 9.4
  Top Layer w0.254: U17.24 65.19,33.77 R83.1 65.3,33.82 R82.1 66.03,34.6 v2(65.99,34.6) ; 64.76,38.92 64.76,37.75 v2(65.52,36.99)
  Bottom Layer w0.254: v2(65.52,36.99) 65.99,36.52 v2(65.99,34.6)
DBRX1: length 21.4
  Top Layer w0.254: U8.19 56.26,45.91 55.27,46.9 53.82,46.9 51.18,44.26 51.18,37.15 v2(53.21,35.12) ; 56.47,33.83 56.47,33.82 56.23,33.59 v2(55.25,33.59)
  Bottom Layer w0.254: v2(53.21,35.12) 54.74,33.59 v2(55.25,33.59)
DBRX2: length 14.5
  Top Layer w0.254: v2(77.34,26.48) 77.35,26.47 TP8.1 ; v2(68.83,28.38) 67.69,29.52 U17.19
  Bottom Layer w0.254: v2(77.34,26.48) 70.74,26.48 v2(68.83,28.38)
DBTX1: length 9.1
  Top Layer w0.254: U8.20 56.76,43.94 56.44,43.63 56.44,40.44 56.49,40.38 56.49,36.39 56.64,36.25
DBTX2: length 16.4
  Top Layer w0.254: TP7.1 78.47,23.94 v2(77.34,23.94) ; U17.20 67.19,29.01 v2(68.83,27.37)
  Bottom Layer w0.254: v2(77.34,23.94) 72.26,23.94 v2(68.83,27.37)
EN_1: length 12.5
  Top Layer w0.254: U6.6 30.05,21.37 29.59,21.83 29.59,26.23 28.83,26.99 26.99,26.99 26.6,26.61 U4.14
EN_2: length 11.3
  Top Layer w0.254: 47.02,16.03 47.02,15.55 46.77,15.3 43.43,15.3 39.37,19.36 U6.8
GPIO65: length 26
  Top Layer w0.254: 31.68,21.86 31.84,22.02 U6.5 34.31,22.02 34.8,21.53 34.8,16.95 v2(32.26,14.41) ; v2(29.34,2.73) 29.75,2.31 CN13.6
  Bottom Layer w0.254: v2(29.34,2.73) 29.34,11.49 v2(32.26,14.41)
GPIO66: length 20.8
  Top Layer w0.254: CN13.1 30.73,8.32 33.27,10.86 v2(35.18,10.86) ; v2(38.51,21.4) 38.54,21.37 U6.9 40.93,21.37 R45.2
  Bottom Layer w0.254: v2(38.51,21.4) 35.92,18.81 35.92,11.6 v2(35.18,10.86)
GPIO72: length 19.4
  Top Layer w0.254: v2(36.96,9.46) 35.81,8.32 CN13.3 ; v2(36.96,15.68) 37.03,15.76 37.03,21.86 38.5,23.32 U6.12 41.14,23.32 R47.2
  Bottom Layer w0.254: v2(36.96,15.68) v2(36.96,9.46)
GPIO73: length 25.3
  Top Layer w0.254: CN13.4 34.96,2.31 v2(34.54,2.73) ; v2(34.54,23.69) 34.26,23.97 U6.2 31.77,23.97 31.74,23.94
  Bottom Layer w0.254: v2(34.54,2.73) v2(34.54,23.69)
HOA1: length 5
  Top Layer w0.254: U10.19 35.79,38.69 v2(36.11,38.37) ; R67.1 v2(37.85,35.5)
  Bottom Layer w0.254: v2(36.11,38.37) 37.85,36.64 v2(37.85,35.5)
HOA2: length 3.9
  Top Layer w0.254: v2(56.47,66.23) 56.51,66.23 57.13,65.61 U19.19 ; R86.1 55.65,68.25 v2(56.35,68.25)
  Bottom Layer w0.254: v2(56.35,68.25) 56.35,66.35 v2(56.47,66.23)
HOB1: length 6.7
  Top Layer w0.254: R69.1 35.21,33.95 34.43,34.72 34.43,36.38 33.78,37.04 U10.16
HOB2: length 4.3
  Top Layer w0.254: U19.16 58.98,66.94 58.55,67.37 58.55,70.18 R88.1
HOC1: length 1.5
  Top Layer w0.254: 31.48,36.88 32.28,37.68 U10.13
HOC2: length 1.5
  Top Layer w0.254: U19.13 60.48,66.46 61.41,67.38
LED1: length 58.5
  Top Layer w0.254: v2(73,34.35) 73,41.87 63.88,50.99 61.98,50.99 61.07,50.09 U8.32 ; v2(86.36,7.05) 86.34,7.03 R52.1
  Bottom Layer w0.254: v2(86.36,7.05) 86.36,20.99 v2(73,34.35)
LED2: length 39.6
  Top Layer w0.254: R75.1 84.84,5.99 84.84,10.35 80.64,14.54 80.64,20.51 79.1,22.06 65.13,22.06 62.61,24.57 62.61,26.73 62.88,27 U17.32
LOA1: length 4
  Top Layer w0.254: R68.1 28.6,39.19 U10.11
LOA2: length 4.1
  Top Layer w0.254: U19.11 64.25,65.11 64.98,65.85
LOB1: length 1.6
  Top Layer w0.254: U10.10 30.92,39.69 R70.1
LOB2: length 1.6
  Top Layer w0.254: U19.10 62.18,64.61 R89.1
LOC1: length 2.4
  Top Layer w0.254: R72.1 30.37,41.83 31,41.2 31,40.45 31.25,40.19 U10.9
LOC2: length 2.2
  Top Layer w0.254: R91.1 61.89,63.37 61.89,63.73 61.51,64.11 U19.9
MID1: length 8.9
  Top Layer w0.254: v2(61.09,44.23) 61.84,44.98 R61.2 62.09,45.28 R56.2 61.43,47.59 U8.27 ; v2(59.26,42.23) 59.26,42.19 R64.2
  Bottom Layer w0.254: v2(59.26,42.23) 61.09,44.05 v2(61.09,44.23)
MID2: length 10.7
  Top Layer w0.254: R83.2 64.56,34.64 64.56,33.33 64.78,33.1 64.78,29.89 64.4,29.5 U17.27 62.76,29.5 R77.2 62.24,30.31 R80.2
MOTOR1-A: length 28.9
  Top Layer w0.254: U4.23 23.24,23.4 22.3,22.46 v2(22.3,22.41)
  Top Layer w2.54: 25.04,12.57 41.58,12.57 CN8.1
  Bottom Layer w0.254: v2(22.54,13.09) 22.3,13.34 v2(22.3,22.41)
MOTOR1-B: length 63.4
  Top Layer w0.254: U4.18 24.01,26.09 v2(24,26.1)
  Top Layer w2.54: CN8.2 47.2,8.91 45.21,6.92 38.99,6.92 37,4.93 25.43,4.93 25.06,4.56
  Bottom Layer w0.254: v2(22.56,5.33) 22.56,7.85 21.21,9.2 21.21,15.05 14.48,21.78 14.48,25.59 16.51,27.62 20.83,27.62 22.35,26.1 v2(24,26.1)
MOTOR2-A: length 44.7
  Top Layer w0.254: v2(52.07,18.2) 52.04,18.22 51.17,18.22 50.68,18.72 U5.23
  Top Layer w2.54: Q9.9 60.36,9.13 CN7.1
  Bottom Layer w0.254: v2(71.37,10.1) 72.14,10.86 72.14,17.49 71.41,18.22 52.09,18.22 v2(52.07,18.2)
MOTOR2-B: length 35.5
  Top Layer w0.254: 49.02,16.03 49.11,15.94 v2(49.53,15.94)
  Top Layer w2.54: CN7.2 65.32,17.21 Q10.9
  Bottom Layer w0.254: v2(71.38,17.5) 71.38,14.55 70.74,13.91 64.38,13.91 62.35,15.94 v2(49.53,15.94)
NSLEEP: length 69
  Top Layer w0.254: v2(45.59,16.07) 46.48,16.07 U5.13 ; v2(49.28,13.27) 60.83,1.71 67.69,1.71 68.24,1.16 70.08,1.16 72.83,3.91 79.28,3.91 80.39,5.02 82.13,5.02 R49.2 ; U4.13 v2(27.94,26.09)
  Bottom Layer w0.254: v2(49.28,13.27) 49.28,13.28 46.49,16.07 v2(45.59,16.07) 35.57,26.09 v2(27.94,26.09)
PH_1: length 10.9
  Top Layer w0.254: U6.3 31.48,23.32 31.24,23.56 31.24,25.08 28.96,27.37 26.67,27.37 26.1,26.8 U4.15
PH_2: length 16.3
  Top Layer w0.254: U6.11 38.61,22.67 37.97,22.03 37.97,19.88 43.05,14.8 46.86,14.8 47.52,15.45 U5.15
PWMAH1: length 29.3
  Top Layer w0.254: U8.33 59.56,50.59 56.61,47.65 v2(52.91,47.65) ; v2(36.45,39.94) 36.2,40.19 U10.22
  Bottom Layer w0.254: v2(36.45,39.94) 45.21,39.94 v2(52.91,47.65)
PWMAH2: length 44.5
  Top Layer w0.254: U19.22 56.73,64.11 56.11,63.5 v2(55.76,63.5) ; U17.33 64.4,26.5 65.15,27.26 v2(65.15,29.02)
  Bottom Layer w0.254: v2(65.15,29.02) 65.15,35.75 63.5,37.4 63.5,50.99 54.86,59.63 54.86,62.6 v2(55.76,63.5)
PWMAL1: length 30.4
  Top Layer w0.254: U10.1 35.43,41.85 v2(35.43,41.85) ; v2(52.91,48.44) 56.75,48.44 59.41,51.09 U8.34
  Bottom Layer w0.254: v2(35.43,41.85) 36.75,40.53 45,40.53 v2(52.91,48.44)
PWMAL2: length 45.5
  Top Layer w0.254: U17.34 64.42,26 v2(65.68,27.27) ; U19.1 57.93,62.5 v2(57.47,62.5)
  Bottom Layer w0.254: v2(65.68,27.27) 66.55,28.13 66.55,37.02 65.51,38.06 65.51,49.75 55.37,59.88 55.37,62.31 55.86,62.8 57.17,62.8 v2(57.47,62.5)
PWMBH1: length 29.3
  Top Layer w0.254: U8.35 59.27,51.59 56.88,49.19 v2(52.91,49.19) ; U10.23 37.73,40.69 v2(38.1,41.06)
  Bottom Layer w0.254: v2(38.1,41.06) 44.78,41.06 v2(52.91,49.19)
PWMBH2: length 45.5
  Top Layer w0.254: U19.23 56.82,63.61 55.94,62.74 v2(55.94,62.13) ; U17.35 64.67,25.5 v2(65.69,26.52)
  Bottom Layer w0.254: v2(55.94,62.13) 55.88,62.07 55.88,60.13 66.93,49.09 66.93,27.76 v2(65.69,26.52)
PWMBL1: length 31.1
  Top Layer w0.254: v2(52.91,50.01) 57.05,50.01 59.14,52.09 U8.36 ; v2(36.45,42.33) 36.3,42.48 34.91,42.48 34.89,42.46 34.52,42.46 34.28,42.22 U10.2
  Bottom Layer w0.254: v2(52.91,50.01) 44.55,41.64 37.14,41.64 v2(36.45,42.33)
PWMBL2: length 46.6
  Top Layer w0.254: U17.36 64.92,25 v2(65.72,25.79) ; U19.2 58.48,62.08 57.88,61.48 v2(57.65,61.48)
  Bottom Layer w0.254: v2(57.65,61.48) 57.65,61.56 57.18,62.04 56.68,62.04 56.39,61.75 56.39,60.39 67.31,49.47 67.31,27.39 v2(65.72,25.79)
PWMCH1: length 28.9
  Top Layer w0.254: v2(37.66,42.17) 36.68,41.19 U10.24 ; U8.37 58.76,52.89 58.61,52.75 58.61,52.74 57.62,51.75 53.86,51.75 v2(52.91,50.81)
  Bottom Layer w0.254: v2(37.66,42.17) 44.28,42.17 v2(52.91,50.81)
PWMCH2: length 45.3
  Top Layer w0.254: v2(66.5,25.76) 65.19,24.45 U17.37 ; v2(56.98,61.48) 56.93,61.53 56.93,62.72 U19.24
  Bottom Layer w0.254: v2(66.5,25.76) 67.69,26.95 67.69,49.85 56.98,60.56 v2(56.98,61.48)
PWMCL1: length 30.1
  Top Layer w0.254: U8.38 58.26,52.89 57.5,52.13 53.48,52.13 v2(52.91,51.57) ; v2(33.83,42.53) 33.78,42.47 U10.3
  Bottom Layer w0.254: v2(52.91,51.57) 44.21,42.86 34.17,42.86 v2(33.83,42.53)
PWMCL2: length 43.9
  Top Layer w0.254: U19.3 58.98,61.83 v2(58.79,61.64) ; U17.38 65.69,24.2 67.23,25.73 v2(67.29,25.73)
  Bottom Layer w0.254: v2(67.29,25.73) 68.07,26.51 68.07,50.23 58.79,59.51 v2(58.79,61.64)
PWMIN1: length 44.3
  Top Layer w0.254: CN11.6 52.54,74.49 v2(53.34,74.49) ; U8.43 55.76,52.65 55.6,52.49 55.4,52.49 55.26,52.63 U8.44 55.26,54.29 54.62,54.93 v2(54.48,54.93)
  Bottom Layer w0.254: 53.21,74.49 62.23,74.49 62.99,73.72 62.99,72.05 61.26,70.32 55.91,70.32 53.53,67.95 52.14,67.95 51.44,67.25 51.44,57.98 v2(54.48,54.93)
PWMIN2: length 55
  Top Layer w0.254: v2(52.07,67.04) 52.32,67.29 CN11.1 ; v2(67.56,24.83) 67.86,24.53 67.87,24.53 68.19,24.2 ; U17.44 68.71,23.49 68.71,22.58 68.54,22.42 68.36,22.42 68.19,22.59 U17.43
  Bottom Layer w0.254: v2(67.56,24.83) 65.79,24.83 62.48,28.13 62.48,50.48 53.85,59.12 53.85,64.83 52.07,66.61 v2(52.07,67.04)
VBA1: length 3.5
  Top Layer w0.254: 37.54,37.23 37.54,38.2 D9.2 36.54,39.19 U10.20
VBA2: length 3.6
  Top Layer w0.254: U19.20 56.69,65.11 D16.2 55.36,65.38 C78.1
VBB1: length 14.5
  Top Layer w0.254: v2(31.29,44.61) 31.29,45.51 31.37,45.59 D10.2 ; U10.17 34.28,37.54 v2(34.81,37.01) 35.42,36.4 C57.1
  Bottom Layer w0.254: v2(31.29,44.61) 31.24,44.56 31.24,39.43 31.62,39.05 31.62,38.04 32.65,37.01 v2(34.81,37.01)
VBB2: length 12.1
  Top Layer w0.254: v2(61.34,59.63) 61.39,59.58 D17.2 ; U19.17 58.48,66.69 v2(58.16,67.01) 57.55,67.62 57.55,68.14
  Bottom Layer w0.254: v2(61.34,59.63) 59.56,61.4 59.56,61.76 57.66,63.67 57.66,66.51 v2(58.16,67.01)
VBC1: length 15.5
  Top Layer w0.254: D11.2 29.59,39.81 29.32,39.55 27.93,39.55 v2(27.81,39.43) ; 29.72,36.27 29.83,36.27 29.91,36.2 32.03,36.2 32.78,36.95 U10.14 ; C58.1 29.57,36 v2(27.81,36)
  Bottom Layer w0.254: v2(27.81,39.43) v2(27.81,36)
VBC2: length 14.1
  Top Layer w0.254: D18.2 63.15,59.6 v2(63.12,59.63) ; 63.18,68.33 61.06,68.33 60.76,68.03 60.76,67.68 v2(60.04,66.96) 59.98,66.9 U19.14
  Bottom Layer w0.254: v2(63.12,59.63) 63.12,63.88 v2(60.04,66.96)
VSA1: length 91.2
  Top Layer w0.254: v2(61.41,49.26) 62.1,49.95 62.1,49.97 ; v2(40.29,38.38) 40.29,38.32 38.25,36.28 36.54,36.28 v2(35.7,37.12) 34.78,38.03 U10.18
  Top Layer w2.54: NOREF#7.1 13.55,73.89 13.55,69.5
  Bottom Layer w0.254: v2(61.41,49.26) 61.47,49.2 61.47,46.25 56.51,41.29 56.51,39.94 54.81,38.24 53.52,38.24 52.45,39.31 41.22,39.31 v2(40.29,38.38) ; v2(14.71,67.46) 15.8,68.54 26.9,68.54 27.69,67.75 27.69,64.46 31.24,60.9 31.24,45.4 32,44.64 32,38.42 32.88,37.54 35.29,37.54 35.69,37.15
  vias: v1(12.06,74.87) v1(12.06,73.6) v1(13.21,75.5) v1(13.21,72.96) v1(14.35,74.87) v1(14.35,73.6)
VSA2: length 70.6
  Top Layer w0.254: v2(52.7,64.96) 52.7,65.83 C78.2 53.47,66.48 54.48,67.5 56.94,67.5 v2(57.01,67.44) 57.01,67.24 U19.18 ; R76.2 60.56,28.54 v2(60.56,29.32)
  Top Layer w2.54: NOREF#2.1 74.15,73.83 74.15,69.52
  Bottom Layer w0.254: v2(57.01,67.44) 57.86,68.29 66.27,68.29 66.79,67.77 v2(73.81,67.77) ; v2(60.56,29.32) 61.98,30.74 61.98,50.23 52.7,59.5 v2(52.7,64.96)
  vias: v1(73.41,74.87) v1(73.41,73.6) v1(74.55,75.5) v1(74.55,72.96) v1(75.69,74.87) v1(75.69,73.6)
VSB1: length 81.6
  Top Layer w0.254: v2(33.27,34.35) 33.28,35.48 U10.15 ; v2(61.09,42.77) 61.11,42.77 R60.2
  Top Layer w2.54: 19.54,69.5 19.54,73.86 NOREF#5.1
  Bottom Layer w0.254: v2(61.09,42.77) 61.09,42.74 55.63,37.27 52.45,37.27 51.44,38.29 44.07,38.29 40.13,34.35 v2(33.27,34.35) 30.73,34.35 29.31,35.78 29.31,55.33 20.7,63.94 v2(20.7,67.52)
  vias: v1(18.03,74.87) v1(18.03,73.6) v1(19.18,75.5) v1(19.18,72.96) v1(20.32,74.87) v1(20.32,73.6)
VSB2: length 71
  Top Layer w0.254: R79.2 63.04,34.23 v2(63.04,34.28) ; C79.2 59.55,67.41 v2(59.53,67.39) 59.48,67.34 U19.15
  Top Layer w2.54: NOREF#3.1 80.42,74.01 80.42,69.52
  Bottom Layer w0.254: v2(63.04,34.28) 63.04,50.69 54.36,59.37 54.36,62.93 57.15,65.72 57.15,66.76 57.94,67.54 59.39,67.54 v2(59.53,67.39) 59.64,67.5 65.41,67.5 67.83,65.09 77.56,65.09 v2(80.16,67.69)
  vias: v1(79.5,74.87) v1(79.5,73.6) v1(80.64,75.5) v1(80.64,72.96) v1(81.79,74.87) v1(81.79,73.6)
VSC1: length 70.6
  Top Layer w0.254: v2(57.23,40.67) 57.23,41.52 R63.2 ; 29.72,38.27 30.13,38.69 U10.12
  Top Layer w2.54: 25.79,69.5 25.79,73.71 NOREF#4.1
  Bottom Layer w0.254: v2(57.23,40.67) 57.23,39.64 55.37,37.78 52.96,37.78 51.94,38.8 43.43,38.8 39.59,34.96 33.74,34.96 30.86,37.84 v2(30.86,38.66) 30.61,38.91 30.61,60.64 27.03,64.22 v2(27.03,67.52)
  vias: v1(24.13,74.87) v1(24.13,73.6) v1(25.27,75.5) v1(25.27,72.96) v1(26.42,74.87) v1(26.42,73.6)
VSC2: length 68.3
  Top Layer w0.254: v2(68.71,36.39) 68.45,36.13 67.62,36.13 R82.2 ; v2(64.32,66.6) 63.58,66.6 C80.2 62.59,65.61 U19.12
  Top Layer w2.54: NOREF#8.1 86.48,73.97 86.48,69.52
  Bottom Layer w0.254: v2(68.71,36.39) 68.71,50.36 63.75,55.31 63.75,66.04 v2(64.32,66.6) 65.41,66.6 67.31,64.71 78.23,64.71 82.65,69.13 82.65,70.14 82.96,70.45 84.66,70.45 v2(85.33,71.12)
  vias: v1(85.6,74.87) v1(85.6,73.6) v1(86.74,75.5) v1(86.74,72.96) v1(87.88,74.87) v1(87.88,73.6)
$1N4655: length 2.5
  Top Layer w0.254: U4.2 25.1,20.41 C20.1
$1N4656: length 7.8
  Top Layer w0.254: 22.92,18.54 22.92,16.61 22.91,16.6 ; 22.92,18.54 C20.2 ; 22.92,18.54 C19.2 ; U4.1 23.06,20.66
$1N4660: length 2.5
  Top Layer w0.254: U4.3 25.6,20.81 26.2,20.22 26.48,20.22
$1N4661: length 4.3
  Top Layer w0.254: U4.4 26.1,21.5 27.14,20.46 27.14,19.21 26.75,18.82 26.48,18.82
$1N4662: length 8.2
  Top Layer w0.254: U4.12 28.51,25.4 29.11,24.8 29.11,23.46 28.55,22.9 U4.7 27.11,22.21 U4.6 27.1,21.85 28.57,20.38 28.57,20.07
$1N4670: length 9.1
  Top Layer w0.254: U4.24 23.55,22.9 22.2,21.56 22.2,19.95 21.7,19.44 21.7,15.03 Q3.4
$1N4671: length 17.2
  Top Layer w0.254: v2(26.42,10.1) 26.95,9.56 26.95,9.35 ; U4.22 22.99,23.9 v2(22.83,23.75)
  Bottom Layer w0.254: v2(26.42,10.1) 22.85,13.66 22.85,23.73 v2(22.83,23.75)
$1N4672: length 35.3
  Top Layer w0.254: U4.17 25.1,26.52 24.71,26.91 23.55,26.91 v2(23.49,26.86) ; Q4.4 21.37,7.27 v2(20.57,8.06)
  Bottom Layer w0.254: v2(20.57,8.06) 20.57,14.67 13.84,21.4 13.84,25.84 16.13,28.13 20.95,28.13 22.22,26.86 v2(23.49,26.86)
$1N4673: length 31.2
  Top Layer w0.254: v2(23.11,25.34) 23.18,25.4 U4.19 ; v2(22.6,8.57) 23.15,8.01 Q6.4
  Bottom Layer w0.254: v2(22.6,8.57) 22.6,12.14 21.78,12.95 21.78,15.49 15.11,22.16 15.11,25.34 16.89,27.11 20.57,27.11 22.35,25.34 v2(23.11,25.34)
$1N4684: length 2.1
  Top Layer w0.254: 49.02,21.84 48.52,21.34 48.52,19.91
$1N4685: length 9.5
  Top Layer w0.254: 49.02,19.91 49.5,19.91 C24.2 51.37,25.16 D5.1 ; 49.02,23.24 50.63,23.24 C23.2
$1N4689: length 2.3
  Top Layer w0.254: 48.02,19.91 48.02,21.07 47.24,21.84
$1N4690: length 4.2
  Top Layer w0.254: 47.24,23.24 47.06,23.24 46.51,22.7 46.51,21.45 47.52,20.45 47.52,19.91
$1N4691: length 8
  Top Layer w0.254: U5.12 44.94,16.72 44.56,17.1 44.56,18.97 44.81,19.22 U5.7 45.83,19.22 46.52,19.91 46.52,19.92 45.08,21.36 45.08,21.72
$1N4697: length 34.8
  Top Layer w0.254: U5.24 50.64,19.22 v2(50.67,19.25) ; v2(72.23,7.36) Q7.4
  Bottom Layer w0.254: v2(72.23,7.36) 72.64,7.77 72.64,17.84 71.63,18.86 51.07,18.86 v2(50.67,19.25)
$1N4698: length 20.3
  Top Layer w0.254: U5.22 49.72,18.22 50.42,18.22 v2(50.67,17.97) ; v2(65.53,14.92) 65.53,14.09 66.78,12.84 Q9.4
  Bottom Layer w0.254: v2(65.53,14.92) 62.86,17.59 51.05,17.59 v2(50.67,17.97)
$1N4699: length 26.2
  Top Layer w0.254: v2(48.89,15.18) 48.52,15.55 U5.17 ; v2(71.1,13.17) 71.65,13.17 72.23,13.75 Q8.4
  Bottom Layer w0.254: v2(71.1,13.17) 63.86,13.17 61.85,15.18 v2(48.89,15.18)
$1N4700: length 22.5
  Top Layer w0.254: Q10.4 70.59,14.18 v2(69.98,14.8) ; U5.19 49.74,16.7 v2(50.67,16.7)
  Bottom Layer w0.254: v2(69.98,14.8) 66.29,14.8 65.89,14.39 65.05,14.39 62.74,16.7 v2(50.67,16.7)
$1N4740: length 79.2
  Top Layer w0.254: U7.2 48.83,52.26 C30.2 50.67,49.91 50.67,36.9 52.7,34.87 52.7,34.14 v2(48.81,30.25) ; v2(50.21,28.89) 52.08,27.02 52.08,19.74 53.29,18.53 53.29,11.8 60.07,5.02 70.13,5.02 71.23,3.91 71.23,4.13 72.12,5.01 72.13,5.01 72.14,5.02 79.38,5.02 80.14,5.78 81.14,5.78 R48.2
  Bottom Layer w0.254: v2(48.81,30.25) 48.85,30.25 v2(50.21,28.89)
$1N4744: length 1.7
  Top Layer w0.254: LED4.2 81.15,2.62 R48.1
$1N4745: length 1.6
  Top Layer w0.254: LED5.2 82.89,4.25 R49.1
$2N1450: length 3.9
  Top Layer w0.254: L1.1 55.45,43.08 ; 55.45,43.08 54.76,43.78 U8.16 ; 55.45,43.08 C35.2
$2N1477: length 2.6
  Top Layer w0.254: U8.13 53.26,44.34 C32.2
$2N2620: length 1.8
  Top Layer w0.254: LED6.1 86.34,2.53 R52.2
$2N5818: length 14.9
  Top Layer w0.254: 33.28,43.35 37.18,43.35 R66.2 38.63,41.96 D9.1 ; 33.28,43.35 U10.4 ; 33.28,43.35 33.28,43.38 D12.1 32.93,43.73 D10.1 31.37,43.78 31.07,44.07 31.06,44.07 30.75,44.38 30.75,44.39 D11.1
$2N6770: length 56.2
  Top Layer w0.254: 11.99,67.03 11.95,66.99 11.56,66.99 10.54,65.98 10.54,62.55 11.68,61.4 v2(31.5,61.4) ; R67.2 38.73,35.51 v2(39.37,36.15)
  Bottom Layer w0.254: v2(31.5,61.4) 31.88,61.02 31.88,45.53 32.64,44.77 32.64,42.97 39.37,36.24 v2(39.37,36.15)
$2N6774: length 46.5
  Top Layer w0.254: 11.55,68.54 9.52,66.52 9.52,62.04 11.18,60.39 22.35,60.39 26.8,55.94 26.8,38.17 R68.2
$2N7452: length 48.2
  Top Layer w0.254: v2(17.4,66.99) 17.97,66.99 18.01,67.03 ; v2(37.92,33.21) 37.99,33.21 R69.2
  Bottom Layer w0.254: v2(17.4,66.99) 17.4,66.48 28.57,55.31 28.57,35.5 30.86,33.21 v2(37.92,33.21)
$2N7454: length 33.5
  Top Layer w0.254: 17.54,68.54 16.89,67.89 v2(16.89,67.88) ; v2(27.94,41.21) 27.94,41.16 R70.2
  Bottom Layer w0.254: v2(27.94,41.21) 27.94,55.18 16.87,66.26 16.87,67.86 v2(16.89,67.88)
$2N7674: length 36.1
  Top Layer w0.254: R71.2 31.28,35.17 v2(30.7,35.17) ; 24.24,67.03 24.2,66.99 23.91,66.99 v2(23.63,66.72)
  Bottom Layer w0.254: v2(23.63,66.72) 29.97,60.38 29.97,35.9 v2(30.7,35.17)
$2N7676: length 30.5
  Top Layer w0.254: v2(28.57,56.96) 27.3,55.69 27.3,43.34 R72.2 ; 23.79,68.54 23.22,67.97 v2(23.16,67.97)
  Bottom Layer w0.254: v2(23.16,67.97) 23.1,67.91 23.1,62.31 28.45,56.96 v2(28.57,56.96)
$3N3040: length 3.9
  Top Layer w0.254: C62.2 68.47,33.87 L2.1 69.19,32.98 U17.16
$3N3052: length 2.3
  Top Layer w0.254: U17.13 70.69,32.67 71.73,33.71 71.73,33.89
$3N3141: length 1.8
  Top Layer w0.254: R75.2 84.62,4.26 LED7.1
$3N3324: length 21.1
  Top Layer w0.254: 59.49,60.92 59.48,60.92 59.48,60.93 ; U19.4 59.48,60.93 ; 59.48,60.93 63.09,60.93 D18.1 ; 59.48,60.93 55.56,60.93 54.08,62.41 D16.1 53.59,64.58 49.02,60.01 R85.2
$3N3402: length 18.6
  Top Layer w0.254: v2(70.99,69.02) 71.11,69.02 73.12,67.01 ; R86.2 56.38,69.78 v2(56.39,69.79)
  Bottom Layer w0.254: v2(70.99,69.02) 57.15,69.02 v2(56.39,69.79)
$3N3404: length 21.2
  Top Layer w0.254: v2(77.68,70.48) 76.16,70.48 76.15,70.47 ; v2(65.91,67.75) 65.39,67.75 R87.2
  Bottom Layer w0.254: v2(65.91,67.75) 68.2,65.47 77.34,65.47 78.99,67.12 78.99,69.17 v2(77.68,70.48)
$3N3419: length 23.9
  Top Layer w0.254: 79.39,67.01 78.23,68.17 v2(78.23,71.56) ; R88.2 60.49,70.85 v2(62.54,70.85)
  Bottom Layer w0.254: v2(78.23,71.56) 63.26,71.56 v2(62.54,70.85)
$3N3421: length 23.7
  Top Layer w0.254: 82.42,70.47 82.69,70.47 v2(83.25,69.91) ; v2(65.02,64.83) 64.69,64.83 R89.2
  Bottom Layer w0.254: v2(65.02,64.83) 65.53,64.33 78.87,64.33 83.25,68.71 v2(83.25,69.91)
$3N3436: length 27.8
  Top Layer w0.254: 85.44,67.01 83.78,68.68 v2(83.78,70.98) ; R90.2 63.36,70.9 v2(63.5,70.9)
  Bottom Layer w0.254: v2(63.5,70.9) 63.63,71.03 83.73,71.03 v2(83.78,70.98)
$3N3438: length 29.3
  Top Layer w0.254: v2(89.28,70.17) 88.98,70.47 88.48,70.47 ; R91.2 65.02,63.63 v2(65.02,63.67)
  Bottom Layer w0.254: v2(65.02,63.67) 65.3,63.94 79.38,63.94 84.23,68.8 87.91,68.8 v2(89.28,70.17)
